# EAGLE design GCDuino5v_v2 (EAGLE 6.3)
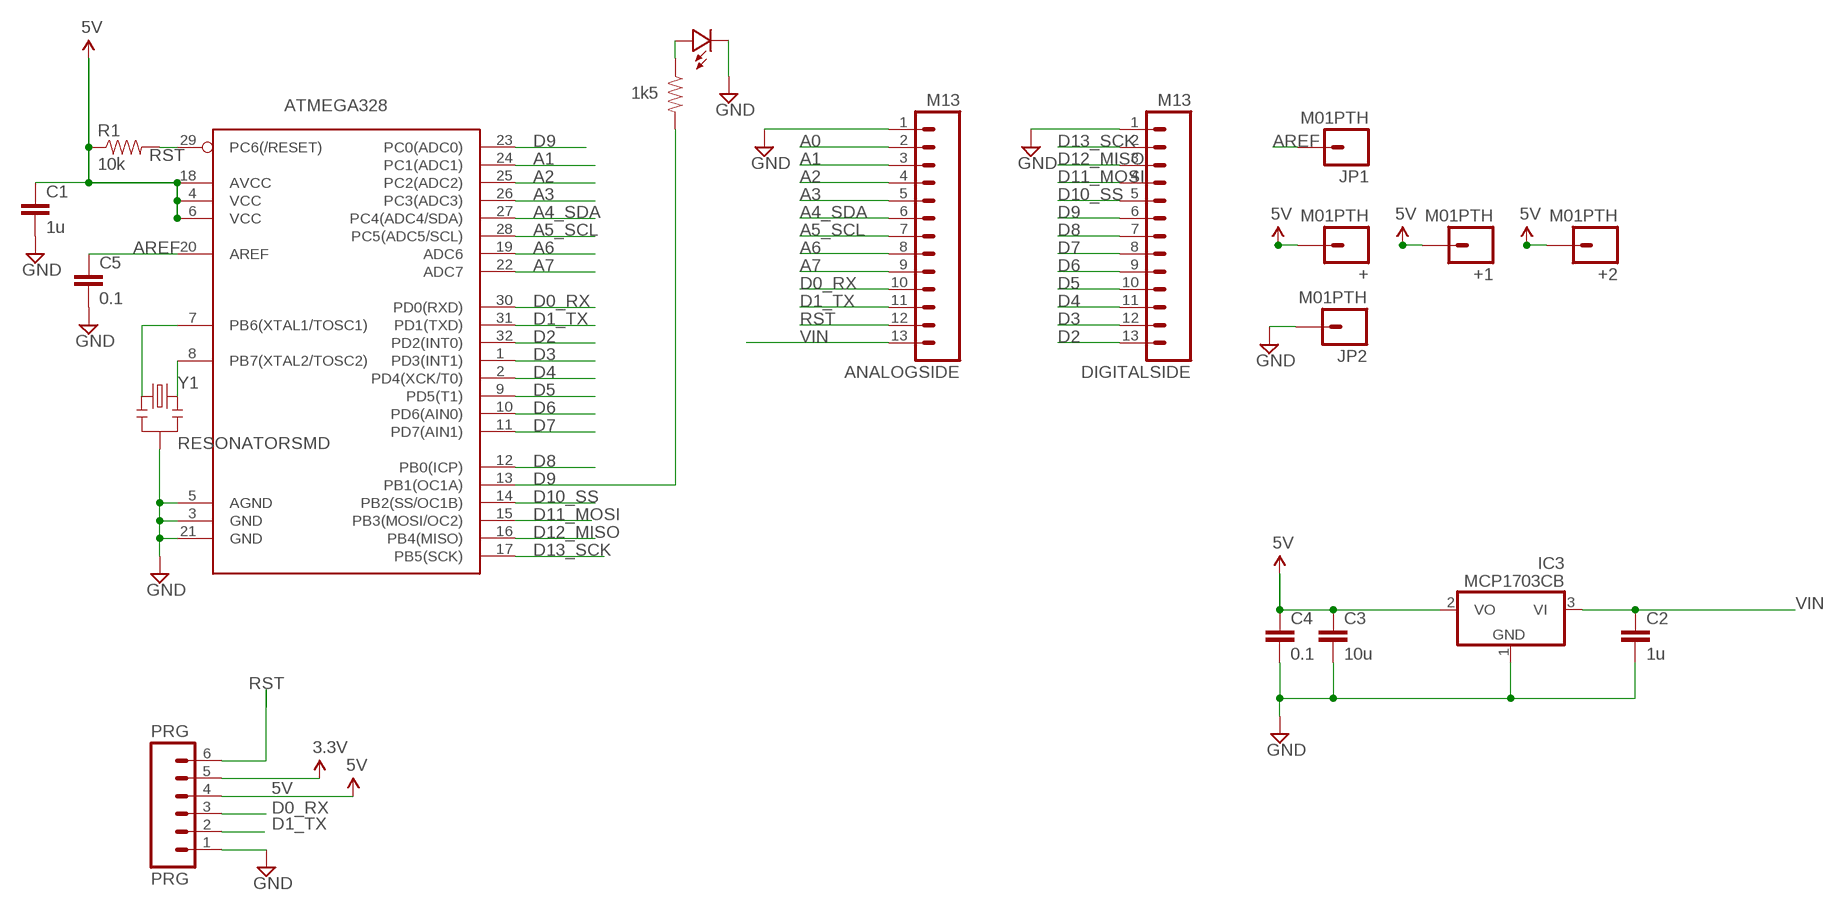
[diagram p0: schematic, sheet 1]

## Parts
+  M01PTH  [1X01]
+1  M01PTH  [1X01]
+2  M01PTH  [1X01]
ANALOGSIDE  M13  [1X13]
ATMEGA328  ATMega-328  ATMEGA168/328TQFP32  [TQFP32-08]
C1  1u  CAP0805  [0805]
C2  1u  CAP0805  [0805]
C3  10u  CAP0805-CAP  [0805-CAP]
C4  0.1  CAP0805  [0805]
C5  0.1  CAP0805  [0805]
DIGITALSIDE  M13  [1X13]
IC3  MCP1703CB  [SOT23]
JP1  M01PTH  [1X01]
JP2  M01PTH  [1X01]
PRG  PRG  M06SIP  [1X06]
R1  10k  RESISTOR0805  [0805]
R2  1k5  RESISTOR0805  [0805]
U$2  LED0805  [0805-LED]
Y1  RESONATORSMD  [RESONATOR-SMD]

## Nets
3.3V: PRG.5
5V [power]: +1.1 +2.1 +.1 ATMEGA328.4(VCC) ATMEGA328.6(VCC) ATMEGA328.18(AVCC) C1.1 C3.1 C4.1 IC3.2(VO) PRG.4 R1.1
A0: ANALOGSIDE.2 ATMEGA328.23(PC0(ADC0))
A1: ANALOGSIDE.3 ATMEGA328.24(PC1(ADC1))
A2: ANALOGSIDE.4 ATMEGA328.25(PC2(ADC2))
A3: ANALOGSIDE.5 ATMEGA328.26(PC3(ADC3))
A4_SDA: ANALOGSIDE.6 ATMEGA328.27(PC4(ADC4/SDA))
A5_SCL: ANALOGSIDE.7 ATMEGA328.28(PC5(ADC5/SCL))
A6: ANALOGSIDE.8 ATMEGA328.19(ADC6)
A7: ANALOGSIDE.9 ATMEGA328.22(ADC7)
AREF: ATMEGA328.20(AREF) C5.1 JP1.1
D0_RX: ANALOGSIDE.10 ATMEGA328.30(PD0(RXD)) PRG.3
D1_TX: ANALOGSIDE.11 ATMEGA328.31(PD1(TXD)) PRG.2
D2: ATMEGA328.32(PD2(INT0)) DIGITALSIDE.13
D3: ATMEGA328.1(PD3(INT1)) DIGITALSIDE.12
D4: ATMEGA328.2(PD4(XCK/T0)) DIGITALSIDE.11
D5: ATMEGA328.9(PD5(T1)) DIGITALSIDE.10
D6: ATMEGA328.10(PD6(AIN0)) DIGITALSIDE.9
D7: ATMEGA328.11(PD7(AIN1)) DIGITALSIDE.8
D8: ATMEGA328.12(PB0(ICP)) DIGITALSIDE.7
D9: ATMEGA328.13(PB1(OC1A)) DIGITALSIDE.6 R2.2
D10_SS: ATMEGA328.14(PB2(SS/OC1B)) DIGITALSIDE.5
D11_MOSI: ATMEGA328.15(PB3(MOSI/OC2)) DIGITALSIDE.4
D12_MISO: ATMEGA328.16(PB4(MISO)) DIGITALSIDE.3
D13_SCK: ATMEGA328.17(PB5(SCK)) DIGITALSIDE.2
GND [power]: ANALOGSIDE.1 ATMEGA328.3(GND) ATMEGA328.5(AGND) ATMEGA328.21(GND) C1.2 C2.2 C3.2 C4.2 C5.2 DIGITALSIDE.1 IC3.1(GND) JP2.1 PRG.1 U$2.MINUS Y1.2
N$1: ATMEGA328.7(PB6(XTAL1/TOSC1)) Y1.1
N$2: R2.1 U$2.PLUS
N$21: ATMEGA328.8(PB7(XTAL2/TOSC2)) Y1.3
RST: ANALOGSIDE.12 ATMEGA328.29(PC6(/RESET)) PRG.6 R1.2
VIN [power]: ANALOGSIDE.13 C2.1 IC3.3(VI)

## Library data of the parts
+ +1 +2 JP1 JP2 = SparkFun-Connectors:M01: Header 1 Standard 1-pin 0.1" header. Use with straight break away headers (SKU : PRT-00116), right angle break away headers (PRT-00553), swiss pins (PRT-00743), machine pins (PRT-00117), and female headers (PRT-00115).
ANALOGSIDE DIGITALSIDE = SparkFun-Connectors:M13: 13-pin single row .1" header
ATMEGA328 = LowPowerLab:ATMEGA168/328: Atmel 32-pin 8-bit micro, 16k flash.
C1-C5 = LowPowerLab:CAP: Capacitor Standard 0603 ceramic capacitor, and 0.1" leaded capacitor.
IC3 = linear:MCP1703: 250 mA, 16V, Low Quiescent Current LDO Regulator Source: http://ww1.microchip.com/downloads/en/DeviceDoc/22049b.pdf
PRG = SparkFun-Connectors:M06: Header 6 Standard 6-pin 0.1" header. Use with straight break away headers (SKU : PRT-00116), right angle break away headers (PRT-00553), swiss pins (PRT-00743), machine pins (PRT-00117), and female headers (PRT-00115). Molex polarized connector foot print use with SKU : PRT-08094 with associated crimp pins and housings. NOTES ON THE VARIANTS LOCK and LOCK_LONGPADS... This footprint was designed to help hold the alignment of a through-hole component (i.e. 6-pin header) while soldering it into place. You may notice that each hole has been shifted either up or down by 0.005 of an inch from it's more standard position (which is a perfectly straight line). This slight alteration caused the pins (the squares in the middle) to touch the edges of the holes. Because they are alternating, it causes a "brace" to hold the component in place. 0.005 has proven to be the perfect amount of "off-center" position when using our standard breakaway headers. Although looks a little odd when you look at the bare footprint, once you have a header in there, the alteration is very hard to notice. Also, if you push a header all the way into place, it is covered up entirely on the bottom side. This idea of altering the position of holes to aid alignment will be further integrated into the Sparkfun Library for other footprints. It can help hold any component with 3 or more connection pins.
R1 R2 = LowPowerLab:RESISTOR: Resistor Basic schematic elements and footprints for 0603, 1206, and PTH resistors.
U$2 = LowPowerLab:LED
Y1 = SparkFun-FreqCtrl:RESONATOR: Resonator Small SMD resonator. This is the itty bitty 10/20MHz resonators with built in caps. CSTCE10M0G55 and CSTCE20M0V53. Footprint has been reviewed closely but hasn't been tested yet.

## Net classes
1 power: width 0.381 mm, clearance 0.254 mm

## Board
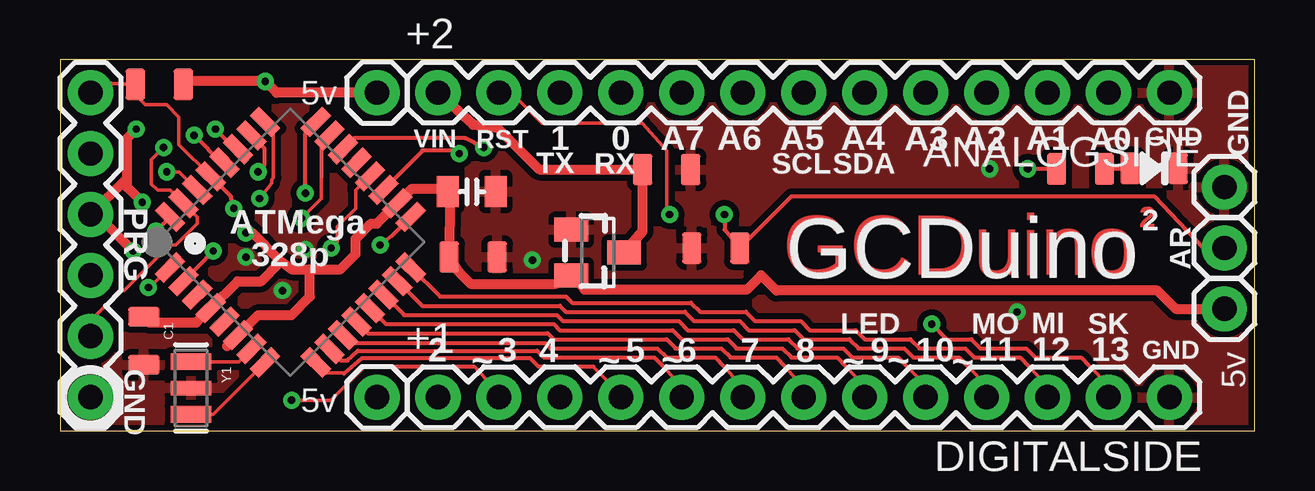
[diagram p1: board, top side]
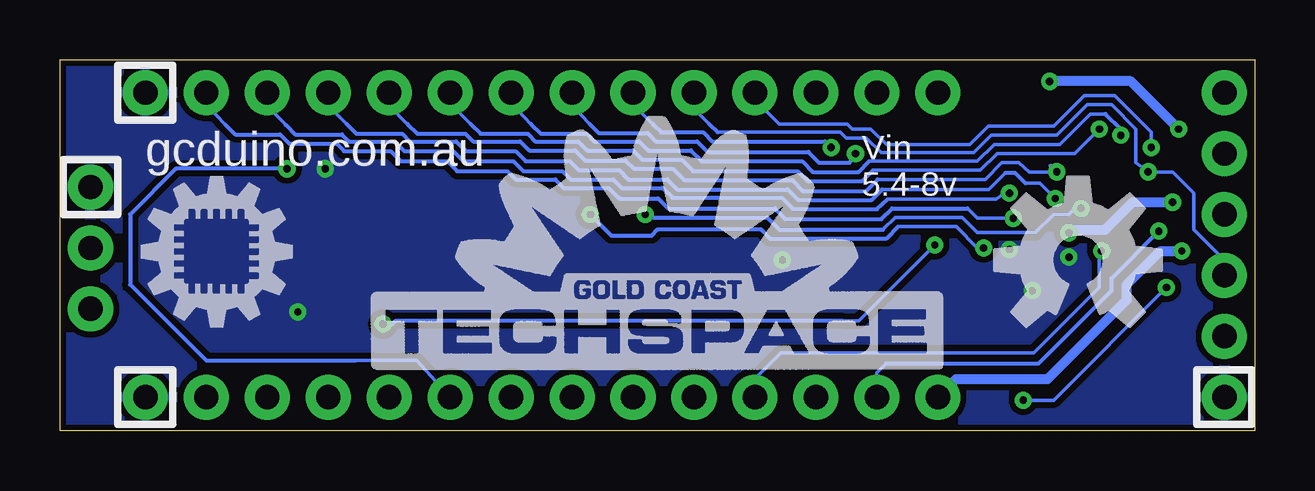
[diagram p2: board, bottom side, seen from below]

Size 49.78 x 15.46 mm. Coordinates in mm from the lower left corner, seen from the top.
Outline: 0,0 49.78,0 49.78,15.46 0,15.46 0,0
Copper layers (1*16): Top 0.035mm / dielectric 1.5mm / Bottom 0.035mm
Design rules "DFRobot_Eagle_Rule_v0.4": minimum track width 6mil, minimum drill 12mil, track to track 6mil, track to pad 6mil, pad to pad 6mil, via to via 6mil, smd to smd 0mil, copper to edge 10mil, drill to drill 10mil, minimum pad ring 12mil, minimum via ring 8mil, stop-mask expansion 2mil, vias tented up to drill 25mil, thermal gap 10mil

### Footprints (pad centres in the part's own frame; a part is rotated, then mirrored left to right if it is on the bottom)
1X01 = drill 1.016 pad 1.88: 1 0,0
1X13 = drill 1.016 pad 1.88: 1 0,0; 2 2.54,0; 3 5.08,0; 4 7.62,0; 5 10.16,0; 6 12.7,0; 7 15.24,0; 8 17.78,0; 9 20.32,0; 10 22.86,0; 11 25.4,0; 12 27.94,0; 13 30.48,0
TQFP32-08 = smd 1.27 x 0.533: 1 -4.293,2.8; 2 -4.293,2; 3 -4.293,1.2; 4 -4.293,0.4; 5 -4.293,-0.4; 6 -4.293,-1.2; 7 -4.293,-2; 8 -4.293,-2.8; 17 4.293,-2.8; 18 4.293,-2; 19 4.293,-1.2; 20 4.293,-0.4; 21 4.293,0.4; 22 4.293,1.2; 23 4.293,2; 24 4.293,2.8 | smd 0.533 x 1.27: 9 -2.8,-4.293; 10 -2,-4.293; 11 -1.2,-4.293; 12 -0.4,-4.293; 13 0.4,-4.293; 14 1.2,-4.293; 15 2,-4.293; 16 2.8,-4.293; 25 2.8,4.293; 26 2,4.293; 27 1.2,4.293; 28 0.4,4.293; 29 -0.4,4.293; 30 -1.2,4.293; 31 -2,4.293; 32 -2.8,4.293
0805 = smd 0.8 x 1.3: 1 -1,0; 2 1,0
0805-CAP = smd 0.902 x 1.3: 1 -1,0; 2 1,0
SOT23 = smd 1 x 1.4: 1 -0.95,-1.1; 2 0.95,-1.1; 3 0,1.1
1X06 = drill 1.016 pad 1.88: 1 0,0; 2 2.54,0; 3 5.08,0; 4 7.62,0; 5 10.16,0; 6 12.7,0
0805-LED = smd 0.8 x 1.3: MINUS -1,0; PLUS 1,0
RESONATOR-SMD = smd 0.7 x 1.7: 1 -1.1,0; 3 1.1,0 | smd 0.6 x 1.7: 2 0,0

### Placement (x,y rotation side)
+  48.51,5.08 270 top
+1  13.21,1.4 0 top
+2  13.21,14.1 0 top
ANALOGSIDE  46.23,14.1 180 top
ATMEGA328  9.6,7.86 45 top
C1  3.49,3.75 270 top
C2  25.27,10.89 0 top
C3  17.16,9.97 0 top
C4  17.21,7.25 0 top
C5  27.32,7.61 180 top
DIGITALSIDE  46.23,1.4 180 top
IC3  22.4,7.43 270 top
JP1  48.51,7.62 0 top
JP2  48.51,10.16 0 top
PRG  1.27,1.4 90 top
R1  4.14,14.44 180 top
R2  42.52,10.92 180 top
U$2  45.59,10.94 180 top
U$6  [ID_LOGO_X0.25]  46.48,4.19 0 bottom
U$7  [OSHW-LOGO-L]  7.37,7.11 0 bottom
U$9  [GCTS_X0.5_TSILK]  36.83,2.41 0 bottom
Y1  5.46,1.78 270 top

### Tracks (layer width: path | path; a pad name or v marks a point on that pad's centre or on a via)
5V  (via drill 0.3)
  Top 0.406: ATMEGA328.18 14.22,9.65 | +.1 46.48,5.08 45.72,5.84 29.84,5.84 29.21,6.48 28.61,5.87 21.84,5.87 21.84,5.94 IC3.2 20.66,6.13 17.11,6.13 16.62,6.62 C4.1 16.24,9.76 C3.1 16.03,10.1 14.66,10.1 ATMEGA328.18 | +2.1 9.02,14.1 v8.55,14.57 5.27,14.57 R1.1 | 9.14,7.11 9.65,6.73 10.41,6.73 | 10.41,6.73 11.68,6.73 12.32,7.37 12.32,8 12.95,8.64 13.2,8.64 ATMEGA328.18 | 2.79,10.54 PRG.4 1.52,9.02 v3.05,7.49 | 2.79,10.54 2.79,12.19 v3.17,12.57 | 6.96,3.52 ATMEGA328.6 8.26,4.83 9.65,4.83 10.41,5.59 10.41,6.73 | 9.14,7.11 9.14,6.99 8.38,6.22 7.4,6.22 ATMEGA328.4 5.68,4.51 3.73,4.51 C1.1 | 9.14,7.11 8,8.26 v7.75,8.26 | v3.43,9.53 2.79,10.16 2.79,10.54
  Bottom 0.406: v3.17,12.57 5.17,14.57 v8.55,14.57 | +1.1 12.45,2.16 8.64,2.16 5.33,5.46 5.33,6.1 3.94,7.49 v3.05,7.49 | v7.75,8.26 7.62,8.38 6.22,8.38 5.08,9.53 v3.43,9.53
A0  (via drill 0.3)
  Top 0.152: 10.89,10.57 10.89,9.68 v10.06,8.86
  Top 0.16: 10.89,10.57 10.89,12.16 11.04,12.31 ATMEGA328.23
  Bottom 0.152: 42.89,12.76 43.69,13.59 ANALOGSIDE.2 | 11.97,9.27 11.56,8.86 v10.06,8.86
  Bottom 0.16: 42.89,12.76 42.48,12.35 40.61,12.35 40.23,11.97 38.26,11.97 37.94,11.65 36.01,11.65 35.59,11.24 33.66,11.24 33.24,10.83 31.15,10.83 30.8,10.48 29.15,10.48 28.8,10.13 26.92,10.13 26.48,9.68 24.86,9.68 24.45,9.27 20,9.27 19.56,8.83 15.56,8.83 15.11,9.27 11.97,9.27
A1  (via drill 0.3)
  Top 0.16: ATMEGA328.24 10.22,12.38 v10.22,9.91
  Bottom 0.152: 15.3,9.65 10.76,9.65 10.41,9.91 | 40.39,12.76 41.15,13.53 ANALOGSIDE.3
  Bottom 0.16: 40.39,12.76 39.97,12.35 38.04,12.35 37.75,12.06 35.85,12.06 35.43,11.65 33.4,11.65 32.99,11.24 30.89,11.24 30.48,10.83 28.86,10.83 28.51,10.48 26.73,10.48 26.38,10.13 24.67,10.13 24.26,9.72 19.72,9.72 19.24,9.24 15.75,9.24 15.3,9.65 | 10.41,9.91 v10.22,9.91
A2  (via drill 0.3)
  Top 0.152: v8.32,9.68 8.83,10.32 8.83,10.48 8.89,10.54 8.89,12.53 ATMEGA328.25
  Bottom 0.152: 15.53,10.06 11.08,10.06 10.38,10.76 | 37.85,12.79 38.61,13.56 ANALOGSIDE.4 | 9.56,10.32 8.95,10.32 v8.32,9.68
  Bottom 0.16: 37.85,12.79 37.43,12.38 35.53,12.38 35.21,12.06 33.27,12.06 32.86,11.65 30.8,11.65 30.39,11.24 28.54,11.24 28.16,10.86 26.48,10.86 26.1,10.48 24.48,10.48 24.07,10.06 19.46,10.06 19.02,9.62 15.97,9.62 15.53,10.06 | 10.38,10.76 10,10.76 9.56,10.32
A3  (via drill 0.3)
  Top 0.16: ATMEGA328.26 8.51,11.78 8.51,11.05 v8.26,10.79
  Bottom 0.152: 15.72,10.48 11.24,10.48 10.54,11.18 9.84,11.18 9.4,10.79 v8.26,10.79 | 35.31,12.79 36.07,13.56 ANALOGSIDE.5
  Bottom 0.16: 35.31,12.79 34.89,12.38 32.89,12.38 32.58,12.06 30.61,12.06 30.23,11.68 28.32,11.68 27.91,11.27 26.23,11.27 25.88,10.92 24.26,10.92 23.78,10.45 19.27,10.45 18.83,10 16.19,10 15.72,10.48 | v8.26,10.79 8.51,11.05
A4_SDA  (via drill 0.3)
  Top 0.16: v6.48,12.57 7.3,11.74 ATMEGA328.27
  Bottom 0.152: 15.91,10.86 11.43,10.86 10.73,11.56 7.49,11.56 v6.48,12.57 | 32.67,12.79 33.53,13.65 ANALOGSIDE.6
  Bottom 0.16: 32.67,12.79 32.26,12.38 30.29,12.38 29.97,12.06 28.19,12.06 27.81,11.68 25.91,11.68 25.53,11.3 23.88,11.3 23.4,10.83 19.05,10.83 18.64,10.41 16.35,10.41 15.91,10.86
A5_SCL  (via drill 0.3)
  Top 0.16: v5.59,12.32 6.73,11.18 ATMEGA328.28
  Bottom 0.152: 16.07,11.24 11.56,11.24 10.86,11.94 8.13,11.94 6.86,13.21 6.22,13.21 | 30.16,12.79 30.99,13.65 ANALOGSIDE.7
  Bottom 0.16: 30.16,12.79 29.75,12.38 27.84,12.38 27.53,12.06 25.65,12.06 25.27,11.68 23.5,11.68 23.05,11.24 18.86,11.24 18.41,10.79 16.51,10.79 16.07,11.24 | 6.22,13.21 5.59,12.57 v5.59,12.32
A6  (via drill 0.3)
  Top 0.16: v16.64,11.56 16.51,11.68 15.11,11.68 ATMEGA328.19
  Bottom 0.152: 27.72,12.79 28.45,13.56 ANALOGSIDE.8
  Bottom 0.16: 27.72,12.79 27.34,12.41 25.3,12.41 24.96,12.06 23.24,12.06 22.8,11.62 18.61,11.62 18.16,11.18 16.89,11.18 16.64,11.43 v16.64,11.56
A7  (via drill 0.3)
  Top 0.16: v17.65,11.81 16.89,12.19 12.23,12.19 ATMEGA328.22 12.11,12.06
  Bottom 0.152: 25.08,12.79 25.91,13.59 ANALOGSIDE.9
  Bottom 0.16: 25.08,12.79 24.73,12.45 22.99,12.45 22.61,12.06 17.91,12.06 v17.65,11.81
AREF  (via drill 0.3)
  Top 0.152: 12.9,10.61 12.32,10.03 12.32,9.27 11.56,8.51 11.56,7.87 v11.3,7.62
  Top 0.16: ATMEGA328.20 12.9,10.61 | v27.69,9.02 27.69,8.38 C5.1 30.48,9.78 45.59,9.78 47.62,7.62 JP1.1 | JP1.1
  Bottom 0.152: 14.86,8.51 12.45,8.51 11.56,7.62 v11.3,7.62
  Bottom 0.16: 14.86,8.51 15.37,8 20.19,8 20.57,8.38 24.89,8.38 25.15,8.13 26.8,8.13 v27.69,9.02
D0_RX  (via drill 0.3)
  Top 0.152: v4.45,10.79 4.97,10.79 ATMEGA328.30
  Bottom 0.152: 22.73,12.79 23.37,13.43 ANALOGSIDE.10 | 22.38,12.45 17.27,12.45 17.02,12.19 16.19,12.19 15.56,11.59 11.72,11.59 10.99,12.32 8.26,12.32 6.99,13.59 5.97,13.59 4.95,12.57 4.95,11.18 v4.45,10.79 3.43,10.79 2.54,9.91 2.54,8.38 1.27,7.11 PRG.3
  Bottom 0.16: 22.73,12.79 22.38,12.45
D1_TX  (via drill 0.3)
  Top 0.152: v4.32,11.81 3.81,11.3 3.81,10.29 4.06,10.03 4.6,10.03 ATMEGA328.31 5.71,8.92 5.71,8.64 4.83,7.75 4.57,7.75 2.67,5.84 2.54,5.84 1.27,4.57 PRG.2
  Bottom 0.152: ANALOGSIDE.11 20.83,13.81 19.81,12.79 16.99,12.79 16.76,12.57 16,12.57 15.34,11.94 11.87,11.94 11.11,12.7 8.38,12.7 7.11,13.97 5.84,13.97 4.32,12.45 v4.32,11.81
D2  (via drill 0.3)
  Top 0.16: ATMEGA328.32 v4,8.33 v4,8.32
  Bottom 0.152: 15.37,2.79 15.75,2.41 DIGITALSIDE.13
  Bottom 0.16: 15.37,2.79 9.02,2.79 5.97,5.84 5.97,6.35 v4,8.32
D3  (via drill 0.3)
  Top 0.152: 17.25,2.68 18.29,1.58 DIGITALSIDE.12 | ATMEGA328.1 3.75,5.97 v3.68,5.97 | v9.65,1.27 11.29,1.27 12.69,2.68
  Top 0.16: 12.69,2.68 17.25,2.68
  Bottom 0.152: v3.68,5.97 8.38,1.27 v9.65,1.27
D4  (via drill 0.3)
  Top 0.16: ATMEGA328.2 5.77,6.86 v6.38,7.49
  Bottom 0.152: DIGITALSIDE.11 20.83,2.16 19.75,3.24 9.21,3.24 6.48,5.97 6.48,7.4 v6.38,7.49
D5
  Top 0.152: 22.23,2.67 23.37,1.49 DIGITALSIDE.10
  Top 0.16: 22.23,2.67 19.94,2.67 19.59,3.02 12.57,3.02 11.84,2.38 11.09,2.41 ATMEGA328.9
  Top 0.254: ATMEGA328.9 10.96,2.54
D6
  Top 0.152: 25.15,2.67 25.91,1.81 DIGITALSIDE.9
  Top 0.16: 25.15,2.67 24.77,3.05 20.16,3.05 19.88,3.33 12.41,3.33 11.97,2.92 11.71,2.92 ATMEGA328.10
D7
  Top 0.152: 27.69,2.67 28.45,1.81 DIGITALSIDE.8
  Top 0.16: ATMEGA328.11 12.11,3.65 20.23,3.65 20.45,3.43 24.89,3.43 25.27,3.05 27.3,3.05 27.69,2.67
D8
  Top 0.152: 30.23,2.67 30.99,1.78 DIGITALSIDE.7
  Top 0.16: 30.23,2.67 29.84,3.05 27.94,3.05 27.56,3.43 25.65,3.43 25.27,3.81 20.57,3.81 20.32,4.06 12.83,4.06 ATMEGA328.12
D9  (via drill 0.32)
  Top 0.152: 32.77,2.67 33.53,1.84 DIGITALSIDE.6
  Top 0.16: 32.77,2.67 32.38,3.05 30.48,3.05 30.1,3.43 28.19,3.43 27.81,3.81 25.91,3.81 25.53,4.19 20.83,4.19 20.57,4.45 13.58,4.45 ATMEGA328.13 | R2.2 v40.33,10.92 v40.32,10.92
  Bottom 0.152: 37.47,2.92 34.92,2.92 DIGITALSIDE.6
  Bottom 0.16: v40.32,10.92 44.96,10.92 46.86,9.02 46.86,6.1 43.69,2.92 37.47,2.92
D10_SS
  Top 0.152: 35.31,2.67 36.07,1.91 DIGITALSIDE.5
  Top 0.16: 35.31,2.67 34.92,3.05 33.02,3.05 32.64,3.43 30.73,3.43 30.35,3.81 28.45,3.81 28.07,4.19 26.16,4.19 25.78,4.57 20.95,4.57 20.7,4.83 14.33,4.83 ATMEGA328.14
D11_MOSI
  Top 0.152: 37.85,2.67 38.61,1.87 DIGITALSIDE.4
  Top 0.16: 37.85,2.67 37.47,3.05 35.56,3.05 35.18,3.43 33.27,3.43 32.89,3.81 30.99,3.81 30.61,4.19 28.7,4.19 28.32,4.57 26.42,4.57 26.04,4.95 21.08,4.95 20.83,5.21 15.08,5.21 ATMEGA328.15
D12_MISO
  Top 0.152: 40.39,2.67 41.15,1.84 DIGITALSIDE.3
  Top 0.16: 40.39,2.67 40.01,3.05 38.1,3.05 37.72,3.43 35.81,3.43 35.43,3.81 33.53,3.81 33.15,4.19 31.24,4.19 30.86,4.57 28.96,4.57 28.57,4.95 26.67,4.95 26.29,5.33 21.34,5.33 21.08,5.59 15.83,5.59 ATMEGA328.16
D13_SCK  (via drill 0.3)
  Top 0.152: 42.86,2.73 43.69,1.87 DIGITALSIDE.2
  Top 0.16: ATMEGA328.17 13.83,8.13 v13.34,7.75 | v36.32,4.45 36.96,3.81 37.97,3.81 38.35,3.43 40.26,3.43 40.64,3.05 42.55,3.05 42.86,2.73
  Bottom 0.152: 17.14,4.57 16.51,4.57 v13.34,7.75
  Bottom 0.16: 17.14,4.57 35.81,4.57 35.94,4.45 v36.32,4.45
GND  (via drill 0.3)
  Top 0.406: ATMEGA328.3 5.72,5.59
  other vias: 9.27,5.84 39.88,4.95 10.22,7.56 7.75,7.24 38.73,10.92 19.68,7.11
  pour Top (isolate 0.16): 0,15.37 49.78,15.37 49.78,0 0,0
  pour Bottom (isolate 0.16): 0,15.37 49.78,15.37 49.78,0 0,0
N$1
  Top 0.152: Y1.1 7.45,2.88 ATMEGA328.7
N$2
  Top 0.16: R2.1 43.39,10.94 U$2.PLUS
N$21
  Top 0.152: ATMEGA328.8 6.38,0.68 Y1.3
RST  (via drill 0.3)
  Top 0.152: v25.4,9.02 25.27,9.14 25.27,11.68 24.26,12.83 20.07,12.83 18.8,14.1 ANALOGSIDE.12 | ATMEGA328.29 4.95,11.94 4.95,13.08 4.45,13.59 3.56,13.59 3.14,14.01 R1.2
  Top 0.16: v7.24,9.27 7.12,9.78 ATMEGA328.29 6.21,10.55 | PRG.6 1.68,14.5 R1.2 3.17,14.4
  Bottom 0.152: 15.49,8.38 14.99,8.89 12.19,8.89 11.56,8.26 9.14,8.26 8.38,9.02 7.75,9.02 7.49,9.27 v7.24,9.27
  Bottom 0.16: v25.4,9.02 25.27,8.89 20.32,8.89 19.81,8.38 15.49,8.38
VIN
  Top 0.406: ANALOGSIDE.13 17.21,12.76 18.22,12.64 19.97,10.89 C2.1 24.27,8.33 IC3.3

### Text on the board
Top: 2 | GCDuino
tPlace: 5v | GND | VIN | 1 | 0 | A7 | A6 | A5 | A4 | A3 | A2 | A1 | RST | TX | RX | A0 | GND | SCL | SDA | AR | ATMega | 2 | 328p | PRG | GCDuino | 2 | 3 | 4 | 5 | 6 | 7 | 8 | LED | 9 | 10 | MO | 11 | MI | 12 | SK | 13 | GND | GND | ~ | ~ | ~ | ~ | ~ | ~ | 5v | 5v
bPlace: gcduino.com.au | Vin / 5.4-8v
tDocu: REG
_bsilk: VIN | 3.3 | 1 | 0 | A7 | A6 | A5 | A4 | A3 | A2 | A1 | A0 | GND | ANT | DTR | GND | 3.3 | + | AREF | GND | 2 | 3 | 4 | 5 | 6 | 7 | 8 | 9 | 10 | 11 | 12 | 13 | RST